# EAGLE design hat (EAGLE 9.6.2)
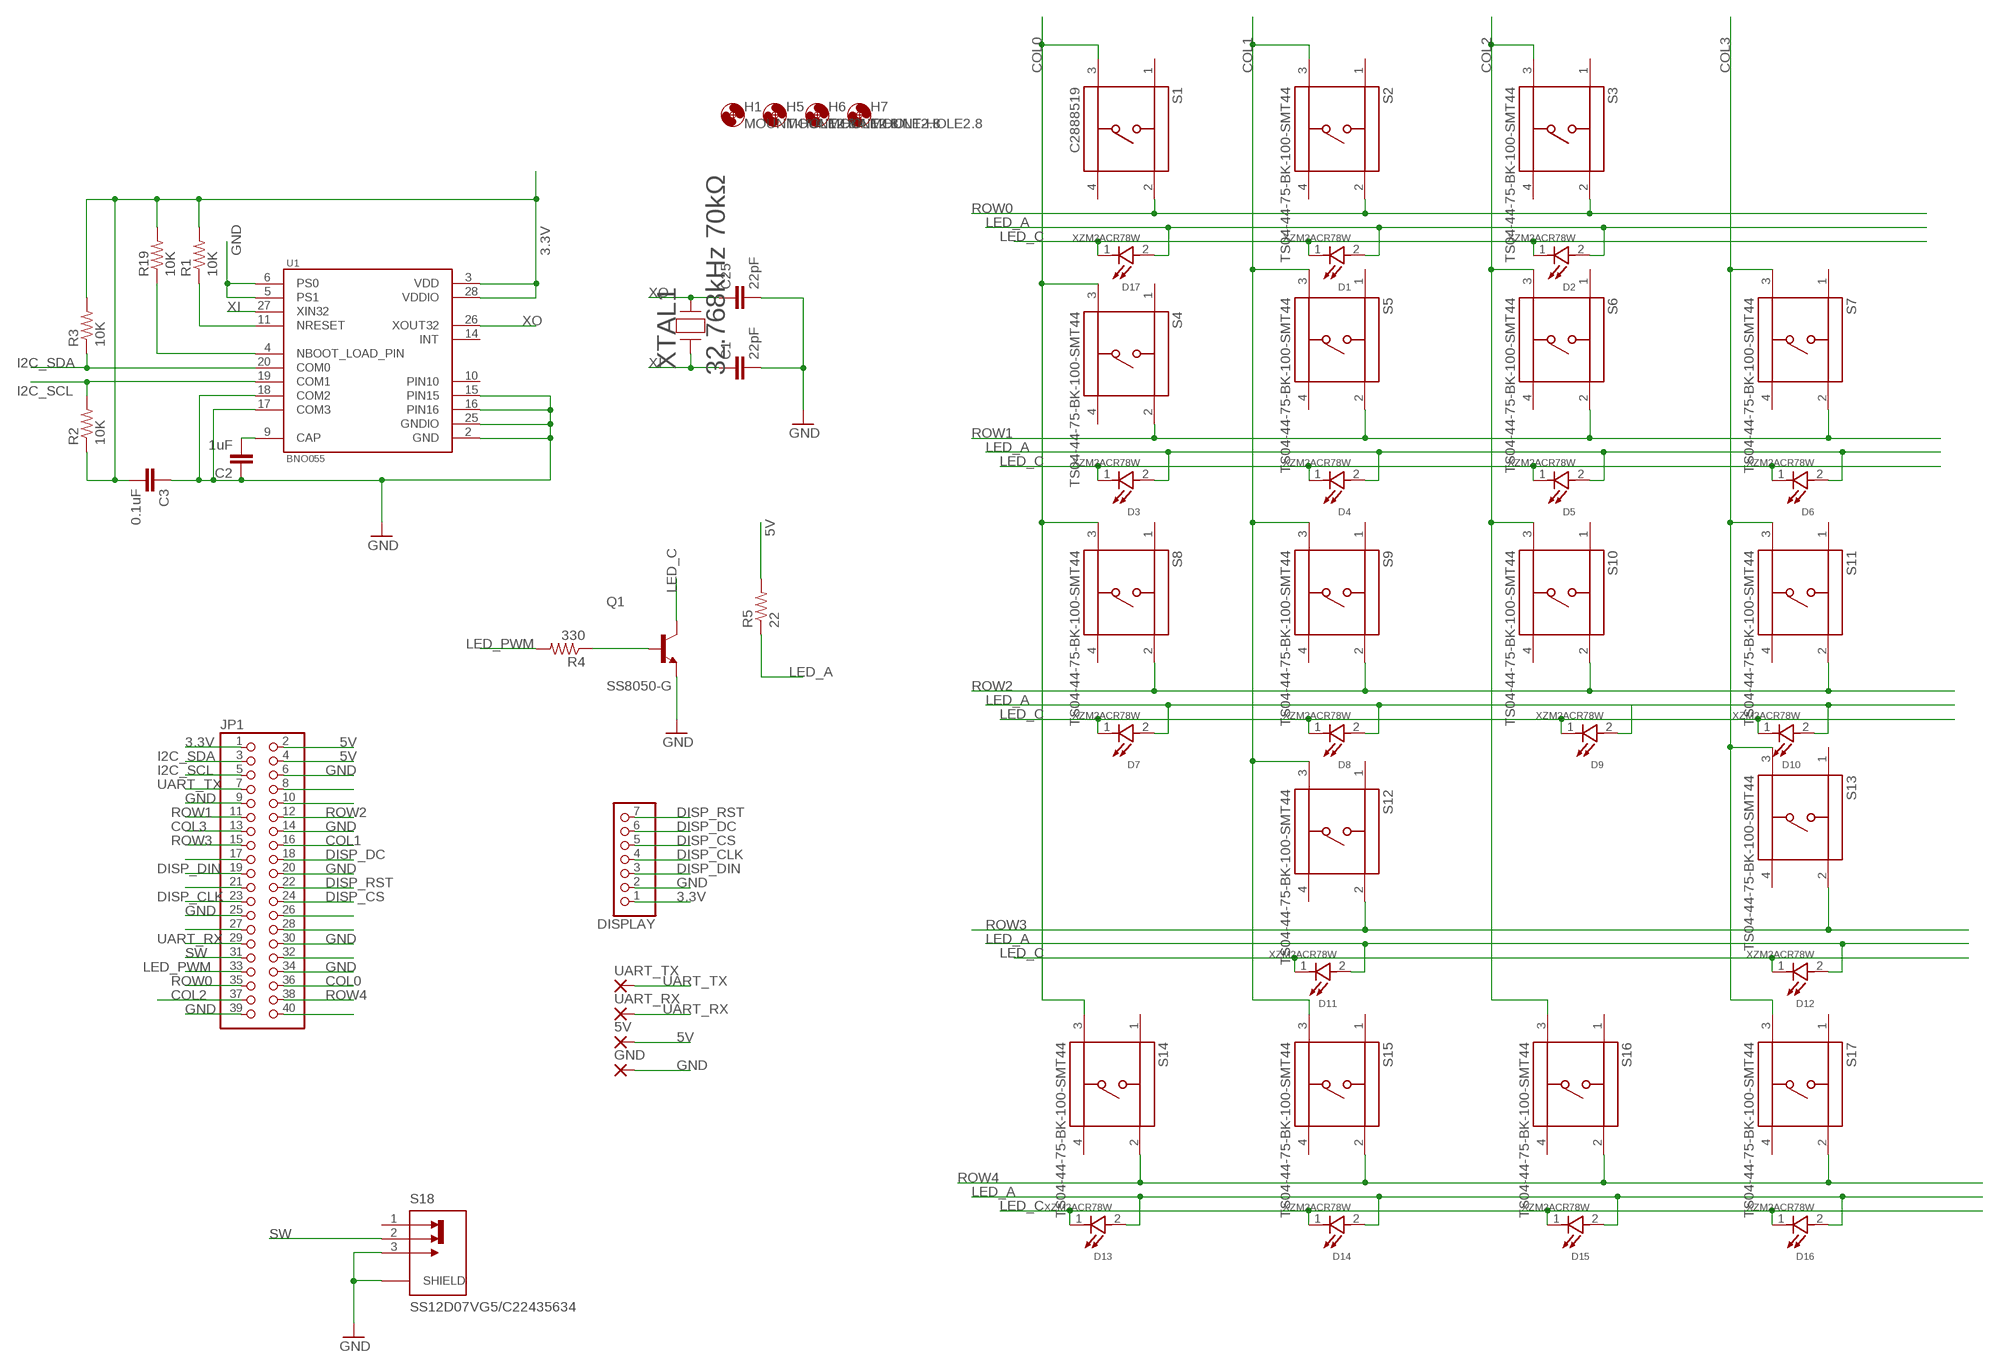
[diagram p0: schematic, sheet 1]

## Parts
5V  SMD2  [SMD1,27-2,54]
C1  22pF  C0603C100C5GACTU  [CAP_0603]
C2  1uF  C0603C100C5GACTU  [CAP_0603]
C3  0.1uF  C0603C100C5GACTU  [CAP_0603]
C25  22pF  C0603C100C5GACTU  [CAP_0603]
D1  XZM2ACR78W  [LED_XZM2ACR78W]
D2  XZM2ACR78W  [LED_XZM2ACR78W]
D3  XZM2ACR78W  [LED_XZM2ACR78W]
D4  XZM2ACR78W  [LED_XZM2ACR78W]
D5  XZM2ACR78W  [LED_XZM2ACR78W]
D6  XZM2ACR78W  [LED_XZM2ACR78W]
D7  XZM2ACR78W  [LED_XZM2ACR78W]
D8  XZM2ACR78W  [LED_XZM2ACR78W]
D9  XZM2ACR78W  [LED_XZM2ACR78W]
D10  XZM2ACR78W  [LED_XZM2ACR78W]
D11  XZM2ACR78W  [LED_XZM2ACR78W]
D12  XZM2ACR78W  [LED_XZM2ACR78W]
D13  XZM2ACR78W  [LED_XZM2ACR78W]
D14  XZM2ACR78W  [LED_XZM2ACR78W]
D15  XZM2ACR78W  [LED_XZM2ACR78W]
D16  XZM2ACR78W  [LED_XZM2ACR78W]
D17  XZM2ACR78W  [LED_XZM2ACR78W]
DISPLAY  PINHD-1X7  [1X07]
GND  SMD2  [SMD1,27-2,54]
H1  MOUNT-HOLE2.8  [2,8]
H5  MOUNT-HOLE2.8  [2,8]
H6  MOUNT-HOLE2.8  [2,8]
H7  MOUNT-HOLE2.8  [2,8]
JP1  PINHD-2X20  [2X20]
Q1  SS8050-G  [TRANS_SS8050-G]
R1  10K  RC0603JR-070RL  [RES_0603]
R2  10K  RC0603JR-070RL  [RES_0603]
R3  10K  RC0603JR-070RL  [RES_0603]
R4  330  RC0603JR-070RL  [RES_0603]
R5  22  RC0603JR-070RL  [RES_0603]
R19  10K  RC0603JR-070RL  [RES_0603]
S1  C2888519  TS04-44-75-BK-100-SMT44  [SW_TS04-44]
S2  TS04-44-75-BK-100-SMT44  [SW_TS04-44]
S3  TS04-44-75-BK-100-SMT44  [SW_TS04-44]
S4  TS04-44-75-BK-100-SMT44  [SW_TS04-44]
S5  TS04-44-75-BK-100-SMT44  [SW_TS04-44]
S6  TS04-44-75-BK-100-SMT44  [SW_TS04-44]
S7  TS04-44-75-BK-100-SMT44  [SW_TS04-44]
S8  TS04-44-75-BK-100-SMT44  [SW_TS04-44]
S9  TS04-44-75-BK-100-SMT44  [SW_TS04-44]
S10  TS04-44-75-BK-100-SMT44  [SW_TS04-44]
S11  TS04-44-75-BK-100-SMT44  [SW_TS04-44]
S12  TS04-44-75-BK-100-SMT44  [SW_TS04-44]
S13  TS04-44-75-BK-100-SMT44  [SW_TS04-44]
S14  TS04-44-75-BK-100-SMT44  [SW_TS04-44]
S15  TS04-44-75-BK-100-SMT44  [SW_TS04-44]
S16  TS04-44-75-BK-100-SMT44  [SW_TS04-44]
S17  TS04-44-75-BK-100-SMT44  [SW_TS04-44]
S18  SS12D07VG5/C22435634  SS12D07VG4  [SW_SS12D07VG4]
U1  BNO055  [LGA28R50P4X10_380X520X100]
UART_RX  SMD2  [SMD1,27-2,54]
UART_TX  SMD2  [SMD1,27-2,54]
XTAL1  32.768kHz 70kΩ  Q13FC1350000400  [XTAL_FC-135_EPS]

## Nets
3.3V: C3.2 DISPLAY.1 JP1.1 R1.2 R2.1 R3.2 R19.2 U1.3(VDD) U1.28(VDDIO)
5V: 5V.1(P) JP1.2 JP1.4 R5.2
COL0: JP1.36 S1.3 S4.3 S8.3 S14.3
COL1: JP1.16 S2.3 S5.3 S9.3 S12.3 S15.3
COL2: JP1.37 S3.3 S6.3 S10.3 S16.3
COL3: JP1.13 S7.3 S11.3 S13.3 S17.3
DISP_CLK: DISPLAY.4 JP1.23
DISP_CS: DISPLAY.5 JP1.24
DISP_DC: DISPLAY.6 JP1.18
DISP_DIN: DISPLAY.3 JP1.19
DISP_RST: DISPLAY.7 JP1.22
GND: C1.2 C2.1 C3.1 C25.2 DISPLAY.2 GND.1(P) JP1.6 JP1.9 JP1.14 JP1.20 JP1.25 JP1.30 JP1.34 JP1.39 Q1.2(E) S18.3 S18.S1(SHIELD) S18.S2(SHIELD) U1.2(GND) U1.5(PS1) U1.6(PS0) U1.15(PIN15) U1.16(PIN16) U1.17(COM3) U1.18(COM2) U1.25(GNDIO)
I2C_SCL: JP1.5 R2.2 U1.19(COM1)
I2C_SDA: JP1.3 R3.1 U1.20(COM0)
LED_A: D1.2(A) D2.2(A) D3.2(A) D4.2(A) D5.2(A) D6.2(A) D7.2(A) D8.2(A) D9.2(A) D10.2(A) D11.2(A) D12.2(A) D13.2(A) D14.2(A) D15.2(A) D16.2(A) D17.2(A) R5.1
LED_C: D1.1(C) D2.1(C) D3.1(C) D4.1(C) D5.1(C) D6.1(C) D7.1(C) D8.1(C) D9.1(C) D10.1(C) D11.1(C) D12.1(C) D13.1(C) D14.1(C) D15.1(C) D16.1(C) D17.1(C) Q1.3(C)
LED_PWM: JP1.33 R4.2
N$1: JP1.17
N$2: R1.1 U1.11(NRESET)
N$3: R19.1 U1.4(NBOOT_LOAD_PIN)
N$6: C2.2 U1.9(CAP)
N$7: Q1.1(B) R4.1
N$11: JP1.21
N$14: JP1.27
N$21: JP1.40
N$25: JP1.32
N$27: JP1.28
N$28: JP1.26
N$36: JP1.10
N$37: JP1.8
ROW0: JP1.35 S1.2 S2.2 S3.2
ROW1: JP1.11 S4.2 S5.2 S6.2 S7.2
ROW2: JP1.12 S8.2 S9.2 S10.2 S11.2
ROW3: JP1.15 S12.2 S13.2
ROW4: JP1.38 S14.2 S15.2 S16.2 S17.2
SW: JP1.31 S18.2
UART_RX: JP1.29 UART_RX.1(P)
UART_TX: JP1.7 UART_TX.1(P)
XI: C1.1 U1.27(XIN32) XTAL1.1
XO: C25.1 U1.26(XOUT32) XTAL1.2
Unconnected: S1.1 S1.4 S2.1 S2.4 S3.1 S3.4 S4.1 S4.4 S5.1 S5.4 S6.1 S6.4 S7.1 S7.4 S8.1 S8.4 S9.1 S9.4 S10.1 S10.4 S11.1 S11.4 S12.1 S12.4 S13.1 S13.4 S14.1 S14.4 S15.1 S15.4 S16.1 S16.4 S17.1 S17.4 S18.1 U1.14(INT)

## Power pins joined to a net without a drawn wire
PIN10: U1.10(PIN10)

## Library data of the parts
5V GND UART_RX UART_TX = wirepad:SMD2: SMD PAD
C1-C3 C25 = Resistor_Capacitor:C0603C100C5GACTU: CAP CER 10PF 50V C0G/NP0 0603 Manufacturer's datasheet <https://content.kemet.com/datasheets/KEM_C1003_C0G_SMD.pdf>; CREATED_BY: PCBLayout.com; DIGIKEY_PART_NUMBER: 399-7814-2-ND; MANUFACTURER: KEMET; MPN: C0603C100C5GACTU; PACKAGE: SMD 0603
D1-D17 = XZM2ACR78W:XZM2ACR78W: Check availability <https://pricing.snapeda.com/parts/XZM2ACR78W/SunLED/view-part?ref=eda>; AVAILABILITY: In Stock; CHECK_PRICES: https://www.snapeda.com/parts/XZM2ACR78W/SunLED/view-part/?ref=eda; DESCRIPTION: Red 625nm LED Indication - Discrete 2.2V 1209 (3224 Metric); MF: SunLED; MP: XZM2ACR78W; PACKAGE: None; PRICE: None; SNAPEDA_LINK: https://www.snapeda.com/parts/XZM2ACR78W/SunLED/view-part/?ref=snap
DISPLAY = pinhead:PINHD-1X7: PIN HEADER
H1 H5-H7 = holes:MOUNT-HOLE: MOUNTING HOLE with drill center marker
JP1 = pinhead:PINHD-2X20: PIN HEADER
Q1 = SS8050-G:SS8050-G: Check availability <https://pricing.snapeda.com/parts/SS8050-G/Comchip%20Technology/view-part?ref=eda>; AVAILABILITY: In Stock; CHECK_PRICES: https://www.snapeda.com/parts/SS8050-G/Comchip/view-part/?ref=eda; DESCRIPTION: Bipolar (BJT) Transistor NPN 25 V 1.5 A 100MHz 300 mW Surface Mount SOT-23-3; MF: Comchip Technology; MP: SS8050-G; PACKAGE: TO-236 Comchip; PRICE: None; SNAPEDA_LINK: https://www.snapeda.com/parts/SS8050-G/Comchip/view-part/?ref=snap
R1-R5 R19 = Resistor_Capacitor:RC0603JR-070RL: RES SMD 0 OHM JUMPER 1/10W 0603 Manufacturer's datasheet <http://www.yageo.com/documents/recent/PYu-RC_Group_51_RoHS_L_10.pdf>; CREATED_BY: PCBLayout.com; DIGIKEY_PART_NUMBER: 311-0.0GRTR-ND; MANUFACTURER: Yageo; MPN: RC0603JR-070RL; PACKAGE: SMD 0603
S1-S17 = TS04-66-75-BK-100-SMT:TS04-44-75-BK-100-SMT: Check availability <https://pricing.snapeda.com/parts/TS04-66-75-BK-100-SMT/Same%20Sky/view-part?ref=eda>
S18 = SS12D07VG4:SS12D07VG4: Check availability <https://pricing.snapeda.com/parts/SS12D07VG4/Shouhan/view-part?ref=eda>; AVAILABILITY: Not in stock; CHECK_PRICES: https://www.snapeda.com/parts/SS12D07VG4/Shouhan/view-part/?ref=eda; DESCRIPTION: Switch Slide ON ON SPDT Top Slide 0.3A 30VDC PC Pins Bracket Mount/Through Hole Automotive Bulk; MF: Shouhan; MP: SS12D07VG4; PACKAGE: Package; PRICE: None; SNAPEDA_LINK: https://www.snapeda.com/parts/SS12D07VG4/Shouhan/view-part/?ref=snap
U1 = BNO055:BNO055: Check availability <https://pricing.snapeda.com/parts/BNO055/Bosch/view-part?ref=eda>; AVAILABILITY: In Stock; CHECK_PRICES: https://www.snapeda.com/parts/BNO055/Bosch/view-part/?ref=eda; DESCRIPTION: BNO055 series Accelerometer, Gyroscope, Magnetometer, 3 Axis Sensor Evaluation Board; MF: Bosch; MP: BNO055; PACKAGE: LGA-28 Bosch; PRICE: None; SNAPEDA_LINK: https://www.snapeda.com/parts/BNO055/Bosch/view-part/?ref=snap
XTAL1 = Q13FC1350000400:Q13FC1350000400: Check availability <https://pricing.snapeda.com/parts/Q13FC1350000400/EPSON/view-part?ref=eda>; AVAILABILITY: In Stock; CHECK_PRICES: https://www.snapeda.com/parts/Q13FC1350000400/Epson/view-part/?ref=eda; DESCRIPTION: 32.768 kHz ±20ppm Crystal 12.5pF 70 kOhms 2-SMD, No Lead; MF: EPSON; MP: Q13FC1350000400; PACKAGE: None; PRICE: None; SNAPEDA_LINK: https://www.snapeda.com/parts/Q13FC1350000400/Epson/view-part/?ref=snap

## Board
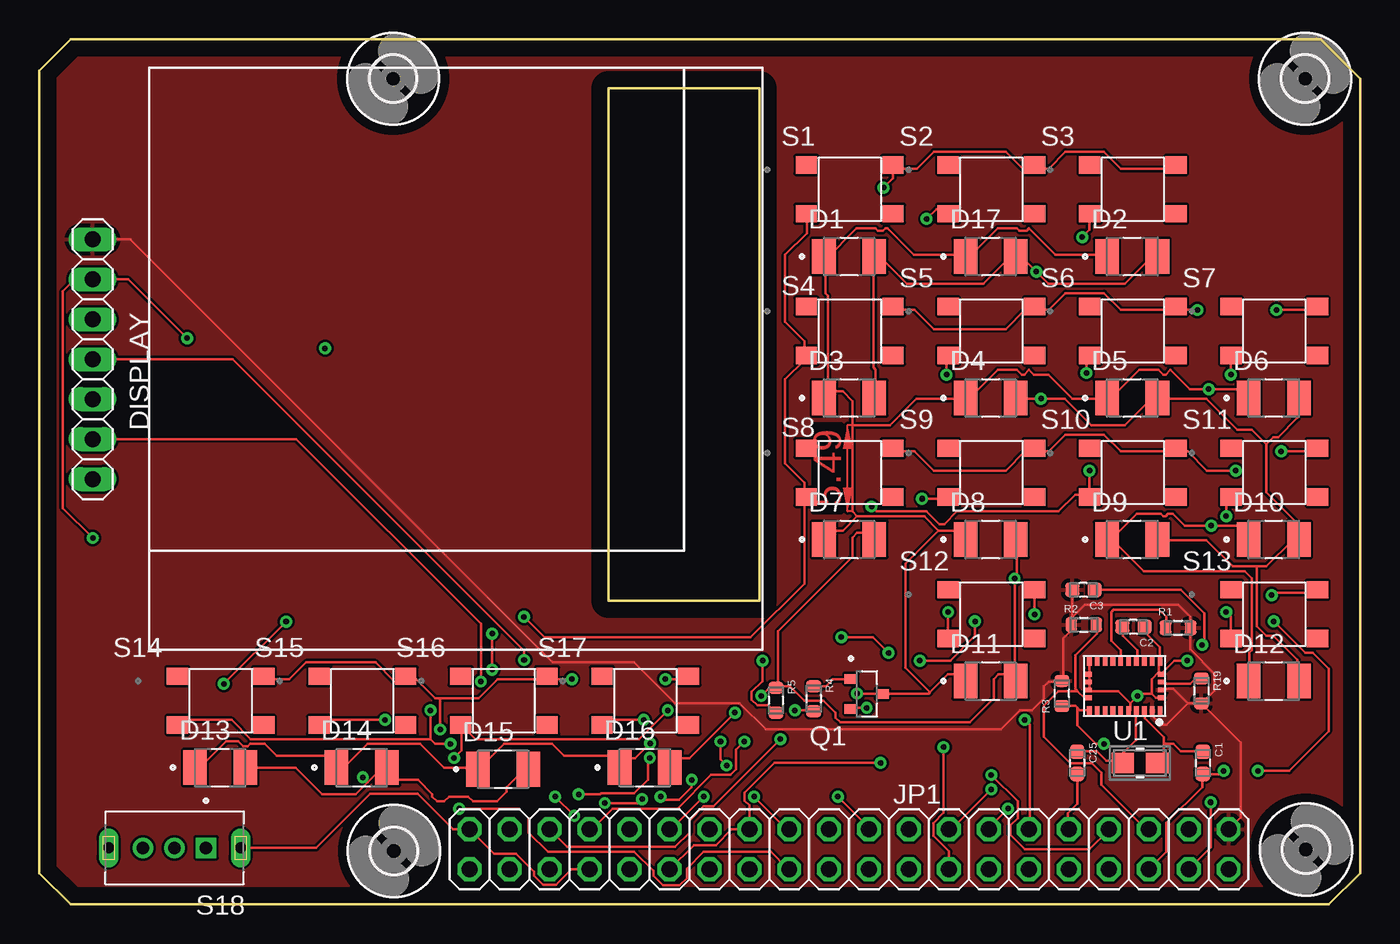
[diagram p1: board, top side]
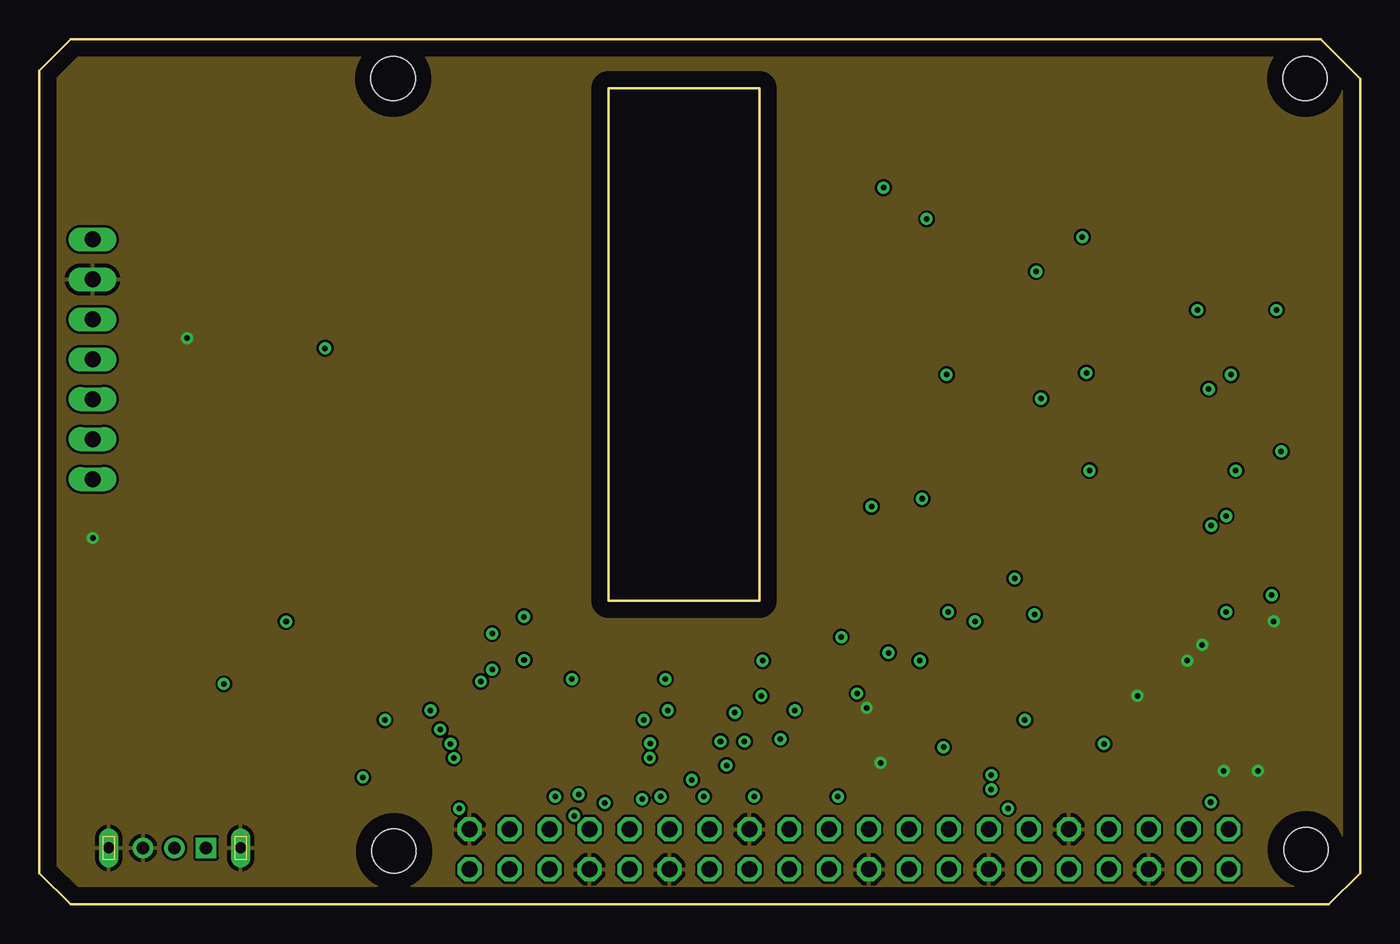
[diagram p2: board, inner layer Route2]
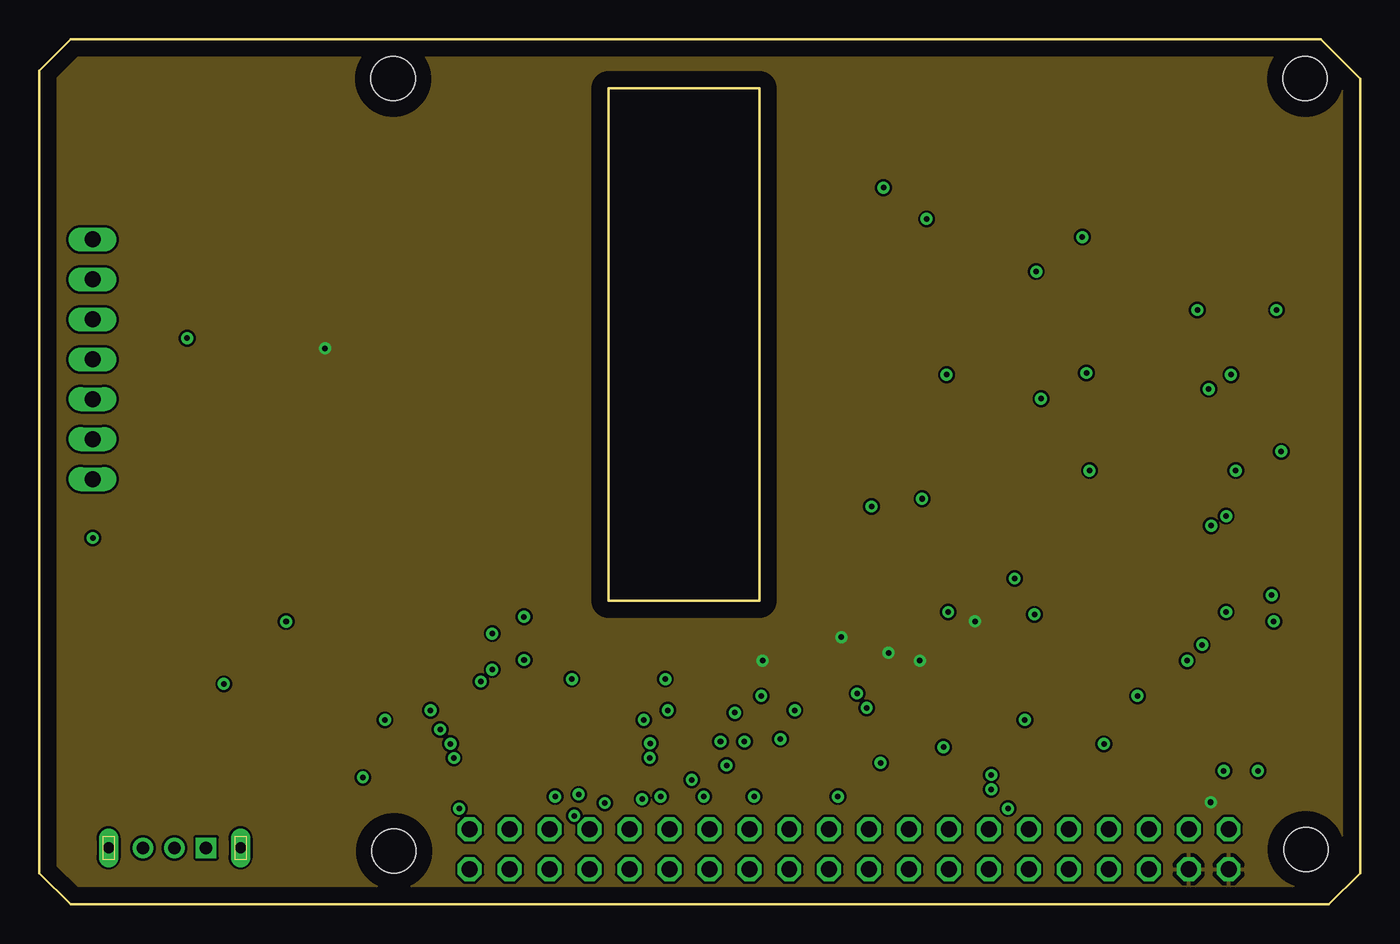
[diagram p3: board, inner layer Route15]
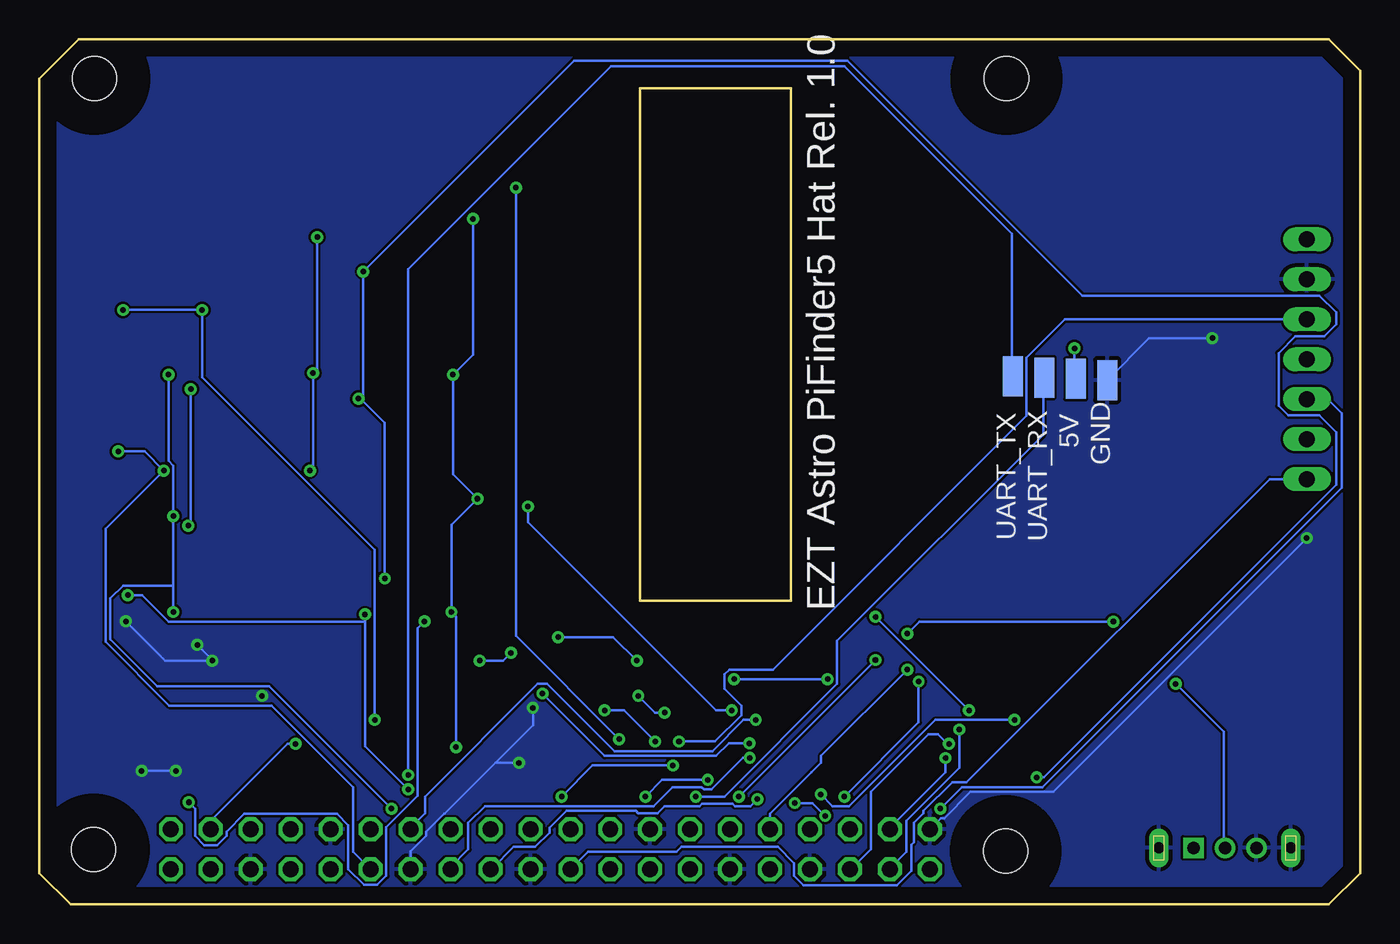
[diagram p4: board, bottom side, seen from below]

Size 84 x 55 mm. Coordinates in mm from the lower left corner, seen from the top.
Outline: 82,0 2,0 0,2 0,53 2,55 81.5,55 84,52.5 84,2 82,0
Outline: 36.2,51.9 45.8,51.9 45.8,19.3 36.2,19.3 36.2,51.9
Copper layers (1+2*15+16): Top 0.035mm / dielectric 0.18mm / Route2 0.017mm / dielectric 1.12mm / Route15 0.017mm / dielectric 0.18mm / Bottom 0.035mm
Design rules "default *": minimum track width 6mil, minimum drill 0.35mm, track to track 6mil, track to pad 6mil, pad to pad 6mil, via to via 6mil, smd to smd 6mil, copper to edge 40mil, drill to drill 6mil, minimum pad ring 10mil, minimum via ring 8mil, stop-mask expansion 4mil, vias tented up to drill 0mil, thermal gap 10mil

### Footprints (pad centres in the part's own frame; a part is rotated, then mirrored left to right if it is on the bottom)
SMD1,27-2,54 = smd 1.27 x 2.54: 1 0,0
CAP_0603 = smd 0.92 x 0.93: 1 -0.705,0; 2 0.705,0
LED_XZM2ACR78W = smd 1.5 x 2.2: 1 -1.6,0; 2 1.6,0
1X07 = drill 1.016 long: 1 -7.62,0; 2 -5.08,0; 3 -2.54,0; 4 0,0; 5 2.54,0; 6 5.08,0; 7 7.62,0
2,8 = hole 2.8: 0,0
2X20 = drill 1.016 octagon: 1 -24.13,-1.27; 2 -24.13,1.27; 3 -21.59,-1.27; 4 -21.59,1.27; 5 -19.05,-1.27; 6 -19.05,1.27; 7 -16.51,-1.27; 8 -16.51,1.27; 9 -13.97,-1.27; 10 -13.97,1.27; 11 -11.43,-1.27; 12 -11.43,1.27; 13 -8.89,-1.27; 14 -8.89,1.27; 15 -6.35,-1.27; 16 -6.35,1.27; 17 -3.81,-1.27; 18 -3.81,1.27; 19 -1.27,-1.27; 20 -1.27,1.27; 21 1.27,-1.27; 22 1.27,1.27; 23 3.81,-1.27; 24 3.81,1.27; 25 6.35,-1.27; 26 6.35,1.27; 27 8.89,-1.27; 28 8.89,1.27; 29 11.43,-1.27; 30 11.43,1.27; 31 13.97,-1.27; 32 13.97,1.27; 33 16.51,-1.27; 34 16.51,1.27; 35 19.05,-1.27; 36 19.05,1.27; 37 21.59,-1.27; 38 21.59,1.27; 39 24.13,-1.27; 40 24.13,1.27
TRANS_SS8050-G = smd 0.8 x 0.6: 1 -1.01,0.95; 2 -1.01,-0.95; 3 1.01,0
RES_0603 = smd 0.74 x 0.93: 1 -0.795,0; 2 0.795,0
SW_TS04-44 = smd 1.35 x 1.1: 1 0.79,0.01; 2 6.29,0.01; 3 0.79,-3.09; 4 6.29,-3.09
SW_SS12D07VG4 = drill 0.8 square: 1 -2,0 | drill 0.8: 2 0,0; 3 2,0 | drill 0.7 pad 1.23 long: S1 -4.2,0; S2 4.2,0
LGA28R50P4X10_380X520X100 = smd 0.3 x 0.525: 1 -2.25,1.562; 6 -2.25,-1.562; 7 -1.75,-1.562; 8 -1.25,-1.562; 9 -0.75,-1.562; 10 -0.25,-1.562; 11 0.25,-1.562; 12 0.75,-1.562; 13 1.25,-1.562; 14 1.75,-1.562; 15 2.25,-1.562; 20 2.25,1.562; 21 1.75,1.562; 22 1.25,1.562; 23 0.75,1.562; 24 0.25,1.562; 25 -0.25,1.562; 26 -0.75,1.562; 27 -1.25,1.562; 28 -1.75,1.562 | smd 0.425 x 0.3: 2 -2.312,0.75; 3 -2.312,0.25; 4 -2.312,-0.25; 5 -2.312,-0.75; 16 2.312,-0.75; 17 2.312,-0.25; 18 2.312,0.25; 19 2.312,0.75
XTAL_FC-135_EPS = smd 1.422 x 1.295: 1 -1.092,0; 2 1.092,0

### Placement (x,y rotation side)
5V  18.09,33.42 0 bottom
C1  74,9 270 top
C2  69.58,17.65 180 top
C3  66.4,20 180 top
C25  66,9 270 top
D1  51.5,41.2 0 top
D2  69.5,41.2 0 top
D3  51.5,32.2 0 top
D4  60.5,32.2 0 top
D5  69.5,32.2 0 top
D6  78.5,32.2 0 top
D7  51.5,23.2 0 top
D8  60.5,23.2 0 top
D9  69.5,23.2 0 top
D10  78.5,23.2 0 top
D11  60.5,14.2 0 top
D12  78.5,14.2 0 top
D13  11.5,8.7 0 top
D14  20.5,8.7 0 top
D15  29.5,8.6 0 top
D16  38.5,8.7 0 top
D17  60.5,41.2 0 top
DISPLAY  3.39,34.66 270 top
GND  16.09,33.34 0 bottom
H1  80.5,52.5 0 top
H5  22.55,3.4 0 top
H6  22.5,52.5 0 top
H7  80.55,3.5 0 top
JP1  51.5,3.5 180 top
Q1  52.62,13.39 0 top
R1  72.42,17.59 0 top
R2  66.42,17.78 0 top
R3  65.03,13.42 90 top
R4  49.25,13.08 270 top
R5  46.84,12.98 270 top
R19  73.9,13.58 270 top
S1  48,47 0 top
S2  57,47 0 top
S3  66,47 0 top
S4  48,38 0 top
S5  57,38 0 top
S6  66,38 0 top
S7  75,38 0 top
S8  48,29 0 top
S9  57,29 0 top
S10  66,29 0 top
S11  75,29 0 top
S12  57,20 0 top
S13  75,20 0 top
S14  8,14.5 0 top
S15  17,14.5 0 top
S16  26,14.5 0 top
S17  35,14.5 0 top
S18  8.6,3.6 180 top
U1  69.02,13.89 180 top
UART_RX  20.09,33.5 0 bottom
UART_TX  22.09,33.58 0 bottom
XTAL1  70,9 180 top

### Tracks (layer width: path | path; a pad name or v marks a point on that pad's centre or on a via)
3.3V
  Top 0.152: 65.57,17.68 65.57,17.37 65.11,16.92 65.11,14.33 R3.2 64.96,14.17 64.2,14.17 63.89,13.87 63.89,13.11 63.13,12.34 62.37,12.34 61.15,11.12 46.22,11.12 44.54,12.8 40.42,12.8 37.83,15.39 32.65,15.39 5.77,42.28 DISPLAY.1 | 65.57,17.68 R2.1 65.72,17.83 65.72,18.29 66.48,19.05 72.43,19.05 73.19,18.29 73.19,17.68 R1.2 73.19,17.53 73.19,16.21 74.72,14.68 74.72,13.6 R19.2 | 73.04,12.8 72.12,13.72 71.36,13.72 U1.3 | 73.04,12.8 73.8,12.8 R19.2 | 73.04,12.8 71.67,11.43 71.36,11.43 70.75,12.04 70.75,12.19 U1.28 | JP1.1 76.4,5.54 76.4,10.29 R19.2 | C3.2 65.69,17.8 65.57,17.68
  pour Top: -6.9,60.6 89.8,60.6 98.3,52.1 98.3,-0.5 89.8,-9 -7.8,-9 -7.8,59.6
5V  (via drill 0.35)
  Top 0.152: JP1.4 74.5,3.64 v74.5,6.5 | R5.2 46.37,12.65 45.66,12.65 45.3,13.01 45.3,13.51 46,14.21 v46,15.5 | v51,17 53,17 v54,16 | v59.5,18 59.5,17.07 57.93,15.5 v56,15.5
  Bottom 0.152: v18.17,35.36 18.17,33.53 5V.1 | v59.5,18 59.93,17.57 59.93,6.91 61.94,4.91 61.94,1.82 62.52,1.24 63.34,1.24 64.35,2.25 64.35,5.05 65.06,5.76 70.96,5.76 72.1,4.62 72.1,4.36 72.68,3.78 73.5,3.78 74.08,4.36 74.08,6.08 v74.5,6.5 | v56,15.5 54.5,15.5 v54,16 | v46,15.5 47.5,17 v51,17
  pour Route15: -1.6,57.1 85.3,57.1 87.5,54.9 87.5,-0.7 86.6,-1.6 86.5,-1.7 -5.4,-1.7 -5.4,53.2
COL0  (via drill 0.35)
  Top 0.152: S1.3 48.81,44.2 48.81,42.67 47.43,41.3 47.43,37.03 48.65,35.81 48.65,35.36 S4.3 48.65,35.2 48.65,34.59 47.43,33.38 47.43,28.04 48.65,26.82 48.65,26.21 S8.3 48.65,26.06 48.65,20.4 45.24,16.99 32.12,16.99 v30.82,18.29 | 24.88,10.52 13.45,10.52 12.23,11.73 8.88,11.73 S14.3 | 24.88,10.52 v24.88,12.34 | 24.88,10.52 25.18,10.22 v26.15,10.22
  Bottom 0.152: v26.15,10.22 26.25,10.22 26.86,10.82 27.47,10.82 31.13,7.16 31.13,3.5 32.35,2.29 JP1.36 | v24.88,12.34 v30.82,18.29
COL1  (via drill 0.35)
  Top 0.152: v57.8,18.59 57.8,17.22 S12.3 | v56.14,25.79 57.38,25.79 57.65,26.06 S9.3 | v56.43,43.59 57.03,44.2 57.65,44.2 S2.3 | v21.98,11.73 17.87,11.73 S15.3 | JP1.16 57.85,3.37 56.86,4.36 56.86,5.18 57.5,5.82 v57.5,10 | v34.3,7 35.65,7 35.71,7.06 37.84,7.06 38.7,7.92 38.7,9.2 v38.82,9.32 | v57.7,33.68 57.7,34.82 S5.3
  Bottom 0.152: v56.43,43.59 56.43,34.95 v57.7,33.68 57.7,27.35 v56.14,25.79 57.8,24.14 v57.8,18.59 57.5,18.3 v57.5,10 | v21.98,11.73 27.01,11.73 32.5,6.25 33.55,6.25 v34.3,7 | JP1.16 57.85,2.38 56.73,3.5 56.73,5.18 55.66,6.25 44.95,6.25 43.73,7.46 41.89,7.46 41.74,7.32 41.24,7.32 39.24,9.32 v38.82,9.32
COL2  (via drill 0.35)
  Top 0.152: 26.86,11.4 26.86,9.81 v26.36,9.31 | 26.86,11.4 26.86,11.58 S16.3 | v66.79,27.58 66.79,26.21 S10.3 66.79,26.06 65.87,26.06 64.81,24.99 58.35,24.99 57.55,24.18 57.23,24.18 56.43,24.99 53.23,24.99 v52.92,25.3 | v66.59,33.78 66.59,35 66.79,35.2 S6.3 | v66.33,42.43 66.79,42.89 66.79,44.2 S3.3 | v39.97,12.34 38.14,10.52 27.74,10.52 26.86,11.4
  Bottom 0.152: v26.36,9.31 26.36,8.42 29.91,4.88 JP1.37 | v66.79,27.58 66.59,27.78 v66.59,33.78 66.33,34.04 v66.33,42.43 | v52.92,25.3 52.92,24.3 40.97,12.34 v39.97,12.34
COL3  (via drill 0.35)
  Top 0.152: v75.48,18.59 75.78,18.29 75.78,17.22 S13.3 | v75.48,24.69 75.48,25.76 75.78,26.06 S11.3 | v75.78,33.68 75.78,35.2 S7.3 | v38.44,11.73 35.85,11.73 S17.3 | v61.61,6.1 60.39,4.88 JP1.13
  Bottom 0.152: 75.48,20.27 v75.48,24.69 75.48,27.89 75.78,28.19 v75.78,33.68 | 75.48,20.27 v75.48,18.59 | v38.44,11.73 39.2,11.73 41.19,9.75 47.43,9.75 51.7,14.02 52.31,14.02 59.47,6.86 59.47,5.79 60.39,4.88 JP1.13 | 75.48,20.27 78.68,20.27 79.48,19.46 79.48,16.86 76.49,13.87 69.38,13.87 v61.61,6.1
DISP_CLK  (via drill 0.35)
  Top 0.152: DISPLAY.4 12.31,34.66 30.83,16.14 v30.83,15.54 | v39.51,6.86 39.71,6.66 40.68,6.66 41.49,7.47 v41.49,7.92 | v45.45,6.86 47.59,4.72 JP1.23
  Bottom 0.152: v39.51,6.86 v30.83,15.54 | v41.49,7.92 44.39,7.92 v45.45,6.86
DISP_CS  (via drill 0.35)
  Top 0.152: v26.71,6.1 30.52,6.1 31.13,5.49 31.13,4.57 32.34,3.36 33.26,3.36 33.26,3.35 37.83,3.35 39.05,2.13 39.05,1.83 39.66,1.22 40.73,1.22 41.19,1.68 41.19,2.29 42.25,3.35 46.52,3.35 47.59,2.29 JP1.24
  Bottom 0.152: v26.71,6.1 25.34,7.47 20.2,7.47 1.17,26.5 1.17,31.24 2.05,32.12 DISPLAY.5
DISP_DC  (via drill 0.35)
  Top 0.152: DISPLAY.6 16.33,29.58 28.08,17.84 v28.08,14.17 | v34.02,5.64 v32.8,6.86 | v35.96,6.45 38.25,6.45 38.34,6.54 v38.34,6.7
  Bottom 0.152: v28.08,14.17 28.08,11.58 v32.8,6.86 | JP1.18 55.21,2.29 53.84,3.66 52.46,3.66 51.55,4.57 51.55,4.88 50.48,5.94 46.06,5.94 45.91,5.79 44.69,5.79 44.23,6.25 42,6.25 41.85,6.4 39.91,6.4 39.76,6.25 38.79,6.25 v38.34,6.7 | v34.02,5.64 34.84,6.45 v35.96,6.45
DISP_DIN  (via drill 0.35)
  Top 0.152: v43.32,10.36 43.32,9.22 v43.7,8.84 | v50.79,6.86 52.77,4.88 JP1.19
  Bottom 0.152: DISPLAY.3 18.77,37.2 21.22,34.75 21.22,31.06 37.34,14.94 40.12,14.94 40.42,14.63 40.42,13.72 39.36,12.65 39.36,12.04 41.03,10.36 v43.32,10.36 | v43.7,8.84 48.81,8.84 v50.79,6.86
DISP_RST
  Bottom 0.152: JP1.22 50.18,2.29 49.11,3.35 43.47,3.35 43.17,3.66 37.03,3.66 36,2.63 36,1.83 35.39,1.22 29.45,1.22 28.54,2.13 28.54,3.81 28.38,3.96 28.38,5.18 27.77,5.79 27.77,5.94 25.95,7.77 25.03,7.77 5.76,27.04 DISPLAY.7
GND  (via drill 0.35)
  Top 0.152: U1.15 66.79,15.39 66.79,14.78 U1.16 66.79,14.63 66.79,14.17 U1.17 66.79,14.02 66.79,13.72 U1.18 66.79,13.56 68.62,13.56 69.38,12.8 | 70.75,13.41 71,13.16 71.31,13.16 U1.2 | 70.75,13.41 70.75,14.33 71.21,14.78 | 69.38,12.8 69.38,12.34 U1.25 | 69.38,12.8 v69.84,13.26 69.99,13.41 70.75,13.41 | 71.21,14.78 71.21,15.39 U1.6 71.26,15.46 71.26,16.35 70.29,17.32 70.29,17.53 C2.1 | 71.21,14.78 U1.5 72.19,15.5 v73,15.5 | v52.62,12.5 51.7,12.5 Q1.2 | C25.2 66.03,8.23 66.03,6.4 65.42,5.79 65.42,4.88 JP1.9 | JP1.6 70.6,2.29 71.67,3.35 71.67,5.18 73.95,7.47 73.95,8.23 C1.2 75.12,8.29 v75.32,8.5 | JP1.30 41.62,3.78 43.02,3.78 44.01,4.77 JP1.25 45.15,6.3 44.85,6.61 44.85,7.11 46.74,9 v53.5,9 | JP1.34 33.85,2.23 32.86,1.24 32.04,1.24 31.46,1.82 31.46,2.08 30.32,3.22 28.92,3.22 JP1.39 26.32,4.77 24.05,7.03 21.05,7.03 17.61,3.6 S18.S1 | v3.4,23.3 1.5,25.2 1.5,39 2.24,39.74 DISPLAY.2 5.66,39.74 v9.4,36 | v78.5,18 80.5,16 81,16 82,15 82,11 79.5,8.5 v77.5,8.5 | C3.1 72.6,20 74.1,18.5 74.1,16.5 v73.95,16.5
  Bottom 0.152: v52.62,12.5 52.62,11.38 55,9 | JP1.14 60.39,3.37 59.4,4.36 59.4,4.62 58.26,5.76 58.24,5.76 55,9 | v53.5,9 55,9 | JP1.39 26.65,5.49 26.46,5.49 24.78,7.16 19.51,7.16 3.4,23.27 v3.4,23.3 | v78.5,18 76,15.5 v73,15.5 73,15.55 v73.95,16.5 | v77.5,8.5 v75.32,8.5 | GND.1 13.43,36 v9.4,36
  pour Route2: 84.3,55.7 85.7,54.3 85.7,1 84.1,-0.6 83.6,-1.1 -2.6,-1.1 -2.6,53.4 -0.3,55.7
  pour Bottom: -3.5,59.2 88.1,59.2 89.1,58.2 90,57.3 90,-2.5 -7.5,-2.5 -8.5,-1.5 -8.5,53.9
I2C_SCL
  Top 0.152: 66.03,13.56 65.87,13.72 65.87,15.85 67.25,17.22 67.25,17.68 R2.2 | 66.03,13.56 66.48,13.11 66.64,13.11 U1.19 | 66.03,13.56 64.81,13.56 63.89,12.65 63.89,10.67 65.57,8.99 66.94,8.99 67.55,8.38 67.55,7.62 70.45,4.72 JP1.5
I2C_SDA  (via drill 0.35)
  Top 0.152: 66.03,12.5 65.87,12.65 65.11,12.65 R3.1 | U1.20 66.64,12.34 66.18,12.34 66.03,12.5 | 66.03,12.5 66.03,11.39 67.2,10.21 v67.7,10.21
  Bottom 0.152: v67.7,10.21 68.2,10.21 73.09,5.32 JP1.3
LED_A  (via drill 0.35)
  Top 0.152: 46.98,13.87 46.98,17.37 51.7,22.1 51.7,23.32 52.01,23.62 53.03,23.62 53.03,23.32 D7.2 | 46.98,13.87 47.74,13.87 48.65,12.95 49.88,12.95 50.63,12.2 50.63,11.89 50.94,11.58 59.17,11.58 60.69,13.11 60.69,14.33 61,14.63 62.03,14.63 | 46.98,13.87 R5.1 46.82,13.72 46.37,13.72 v45.91,13.26 | v44.23,12.19 41.34,9.3 40.23,9.3 40.23,8.84 D16.2 | 62.03,14.63 62.03,14.33 D11.2 62.03,14.63 | 62.03,14.63 v62.03,20.73 62.18,20.88 62.18,23.16 D8.2 | D4.2 62.18,32.16 v63.7,32.16 65.23,32.16 66.9,30.48 69.04,30.48 70.71,32.16 71.02,32.16 D5.2 71.17,32.16 74.22,32.16 76.2,30.18 77.11,30.18 78.03,29.26 | 77.42,21.49 78.03,21.49 79.7,23.16 80.01,23.16 D10.2 80.01,23.32 80.01,24.23 78.03,26.21 78.03,29.26 | 77.42,21.49 75.89,21.49 74.22,23.16 71.17,23.16 D9.2 | 77.42,21.49 77.42,17.68 78.03,17.07 78.49,17.07 80.01,15.54 80.01,14.33 D12.2 | 78.03,29.26 78.49,29.72 78.79,29.72 80.01,30.94 80.01,32.16 D6.2 | 20.88,7.77 21.79,8.69 22.1,8.69 | 20.88,7.77 20.12,7.01 17.98,7.01 16.31,8.69 13.11,8.69 D13.2 | 22.1,8.69 22.86,7.92 24.08,7.92 24.99,7.01 24.99,6.86 25.3,6.55 25.76,6.55 26.06,6.86 27.28,6.86 27.58,6.55 29.11,6.55 29.72,7.16 29.72,7.47 30.79,8.53 31.09,8.53 D15.2 | 22.1,8.69 D14.2 | D3.2 53.19,32.31 53.19,33.98 53.03,34.14 53.03,41.15 D1.2 53.19,41.15 53.49,41.15 55.17,39.47 60.05,39.47 61.72,41.15 62.03,41.15 D17.2 62.18,41.15 62.48,41.15 v63.4,40.23 64.16,39.47 69.04,39.47 70.71,41.15 71.02,41.15 D2.2 | v20.57,8.08 20.88,7.77
  Bottom 0.152: v44.23,12.19 44.84,12.19 v45.91,13.26 | v20.57,8.08 20.12,8.08 1.52,26.67 1.52,30.02 2.59,31.09 4.57,31.09 5.18,31.7 5.18,35.05 4.12,36.12 2.29,36.12 1.52,36.88 1.52,37.64 2.59,38.71 17.68,38.71 32.61,53.65 49.99,53.65 v63.4,40.23 63.4,32.31 63.55,32.16 | v62.03,20.73 62.03,30.63 63.55,32.16 | 63.55,32.16 v63.7,32.16
LED_C  (via drill 0.35)
  Top 0.152: 56.65,13.48 57.8,14.63 58.83,14.63 58.83,14.33 D11.1 | 56.65,13.48 56.58,13.41 53.68,13.41 Q1.3 53.53,13.41 v52.01,13.41 | 52.01,24.69 51.09,23.77 49.99,23.77 49.99,23.32 D7.1 | 52.01,24.69 56.27,24.69 57.19,23.77 | 57.19,23.77 58.83,23.77 58.83,23.32 D8.1 | 56.65,13.48 55.08,15.04 55.08,21.66 57.19,23.77 | v38.85,10.25 37.9,9.3 37.03,9.3 37.03,8.84 D16.1 36.88,9.3 36.73,9.45 33.38,9.45 32.61,10.21 29.57,10.21 28.04,8.69 D15.1 27.89,8.69 25.76,8.69 24.23,10.21 20.88,10.21 19.51,8.84 19.05,8.84 D14.1 18.9,8.84 18.29,9.45 15.09,9.45 14.33,10.21 13.41,10.21 13.26,10.06 12.95,10.06 12.65,10.36 11.89,10.36 10.36,8.84 9.91,8.84 D13.1 | 50.14,32.61 51.09,32.61 51.7,32 51.7,30.48 | 50.14,32.61 49.99,32.61 49.99,32.31 D3.1 50.14,32.61 | 51.7,30.48 51.7,24.99 52.01,24.69 | 68.12,23.32 68.28,23.32 69.8,24.84 71.32,24.84 71.48,24.69 71.63,24.69 71.78,24.84 72.08,24.84 72.85,24.08 v74.52,24.08 76.2,24.08 76.96,23.32 D10.1 | 68.12,23.32 67.97,23.32 D9.1 68.12,23.32 | 68.12,23.32 70.26,21.18 76.66,21.18 77.11,20.73 77.11,16.15 76.96,16 76.96,14.33 D12.1 | D6.1 76.81,32.31 76.35,32.77 v74.37,32.77 73.15,32.77 71.93,33.98 71.63,33.68 71.48,33.68 71.17,33.98 69.95,33.98 68.28,32.31 67.97,32.31 D5.1 67.82,32.16 65.68,32.16 64.16,33.68 63.25,33.68 62.94,33.98 62.64,33.68 62.48,33.68 62.18,33.98 60.96,33.98 59.28,32.31 58.98,32.31 D4.1 58.83,32.16 55.78,32.16 54.1,30.48 51.7,30.48 | 49.99,41 49.99,38.86 50.14,38.71 50.14,32.61 | 49.99,41 49.99,41.15 D1.1 49.99,41 | 49.99,41 51.97,42.98 53.19,42.98 53.34,42.82 53.65,42.82 53.8,42.98 53.95,42.98 55.63,41.3 58.83,41.3 D17.1 58.98,41.3 59.28,41.3 60.96,42.98 62.18,42.98 62.33,42.82 62.79,42.82 62.94,42.98 64.62,41.3 67.82,41.3 D2.1
  Bottom 0.152: v52.01,13.41 48.04,9.45 40.95,9.45 40.15,10.25 v38.85,10.25 | v74.52,24.08 74.37,24.08 v74.37,32.77
LED_PWM  (via drill 0.35)
  Top 0.152: v48.04,12.34 49.11,12.34 R4.2 | JP1.33 35.09,4.72 36.46,6.1 40.58,6.1 42.71,8.23 43.96,8.23 44.31,8.59 44.31,9.83 v44.84,10.36
  Bottom 0.152: v48.04,12.34 46.82,12.34 v44.84,10.36
N$2
  Top 0.152: U1.11 68.77,16.15 68.16,16.76 68.16,18.59 68.31,18.75 71.21,18.75 71.67,18.29 71.67,17.68 R1.1
N$3
  Top 0.152: U1.4 71.36,14.17 71.51,14.17 71.67,14.02 73.19,14.02 73.49,14.33 73.8,14.33 R19.1
N$6
  Top 0.152: U1.9 69.84,15.54 69.84,16.15 68.92,17.07 68.92,17.53 C2.2
N$7
  Top 0.152: Q1.1 51.55,14.33 50.48,14.33 50.02,13.87 49.26,13.87 R4.1
ROW0  (via drill 0.35)
  Top 0.152: S3.2 72.28,46.79 68.77,46.79 67.7,47.85 65.27,47.85 64.2,46.79 63.44,46.79 S2.2 63.28,46.63 62.67,46.63 61.45,47.85 56.88,47.85 55.82,46.79 54.29,46.79 S1.2 54.29,46.63 54.29,46.18 v53.68,45.57 | v47.13,10.52 42.86,6.25 42.25,6.25 41.34,5.33 41.34,4.57 40.42,3.66 33.57,3.66 32.5,4.72 JP1.35
  Bottom 0.152: v47.13,10.52 53.68,17.07 v53.68,45.57
ROW1  (via drill 0.35)
  Top 0.152: S4.2 54.29,37.8 55.66,37.8 56.88,36.58 61.45,36.58 62.67,37.8 63.28,37.8 S5.2 63.44,37.8 64.2,37.8 65.27,38.86 67.7,38.86 68.77,37.8 72.28,37.8 S6.2 72.43,37.8 v73.65,37.8 | v78.68,37.8 81.27,37.8 S7.2 | v62.67,11.73 62.98,11.43 62.98,4.88 JP1.11
  Bottom 0.152: v78.68,37.8 v73.65,37.8 73.65,33.53 62.67,22.55 v62.67,11.73
ROW2  (via drill 0.35)
  Top 0.152: S8.2 54.29,28.8 55.66,28.8 56.88,27.58 61.45,27.58 62.67,28.8 63.28,28.8 S9.2 63.44,28.8 64.2,28.8 65.27,29.87 67.7,29.87 68.77,28.8 72.28,28.8 S10.2 72.43,28.8 73.04,28.8 74.26,27.58 v76.08,27.58 | v78.98,28.8 81.27,28.8 S11.2
  Bottom 0.152: v78.98,28.8 77.3,28.8 v76.08,27.58 79.79,23.88 79.79,16.7 75.73,12.65 69.23,12.65 64.05,7.47 64.05,3.35 62.98,2.29 JP1.12
ROW3  (via drill 0.35)
  Top 0.152: v63.28,18.44 63.28,19.66 S12.2 | v60.54,7.32 57.95,4.72 JP1.15 | v78.37,19.66 78.52,19.81 81.27,19.81 S13.2
  Bottom 0.152: 63.28,17.98 63.28,10.06 v60.54,7.32 | 63.28,17.98 v63.28,18.44 | v78.37,19.66 77.46,19.66 75.78,17.98 63.28,17.98
ROW4  (via drill 0.35)
  Top 0.152: S14.2 14.36,14.33 15.89,14.33 16.95,15.39 21.37,15.39 22.59,14.17 23.2,14.17 S15.2 23.36,14.33 23.96,14.33 25.18,13.11 25.49,13.11 | 25.49,13.11 27.93,13.11 29.15,14.33 32.19,14.33 S16.2 32.35,14.33 v33.87,14.33 | v39.81,14.33 41.19,14.33 S17.2 | 25.49,13.11 v25.49,11.12
  Bottom 0.152: v33.87,14.33 v39.81,14.33 | v25.49,11.12 25.49,8.69 28.84,5.33 28.84,3.35 29.91,2.29 JP1.38
SW  (via drill 0.35)
  Top 0.152: v15.7,17.98 v11.73,14.02 | v28.8,14.94 v28.8,17.22
  Bottom 0.152: JP1.31 37.53,5.77 34.9,8.4 34.29,9.01 34.29,9.45 v28.8,14.94 | v11.73,14.02 8.69,10.97 8.69,3.66 S18.2 | v15.7,17.98 28.04,17.98 v28.8,17.22
UART_RX  (via drill 0.35)
  Top 0.152: v42.25,6.86 40.12,4.72 JP1.29
  Bottom 0.152: v42.25,6.86 40.42,6.86 33.26,14.02 33.26,16.76 20.15,29.87 20.15,33.38 UART_RX.1
UART_TX  (via drill 0.35)
  Top 0.152: v60.54,8.23 62.22,6.55 62.22,5.49 61.76,5.03 61.76,4.42 62.67,3.5 66.79,3.5 68.01,4.72 JP1.7
  Bottom 0.152: v60.54,8.23 60.54,40.39 47.63,53.3 32.79,53.3 22.14,42.64 22.14,33.68 22.09,33.63 UART_TX.1
XI
  Top 0.152: 71.51,10.21 71.51,9.45 71.21,9.14 XTAL1.1 | 71.51,10.21 71.51,10.62 70.29,11.84 70.29,12.19 U1.27 | 71.51,10.21 72.12,10.21 72.58,9.75 73.95,9.75 C1.1
XO
  Top 0.152: U1.26 69.74,12.29 69.74,10.43 68.91,9.6 XTAL1.2 68.54,9 68.4,9.14 67.86,9.14 67.25,9.75 66.03,9.75 C25.1
(copper drawn outside any net)
  shapes: Top area x1

### Text on the board
bPlace: EZT Astro PiFinder5 Hat Rel. 1.0